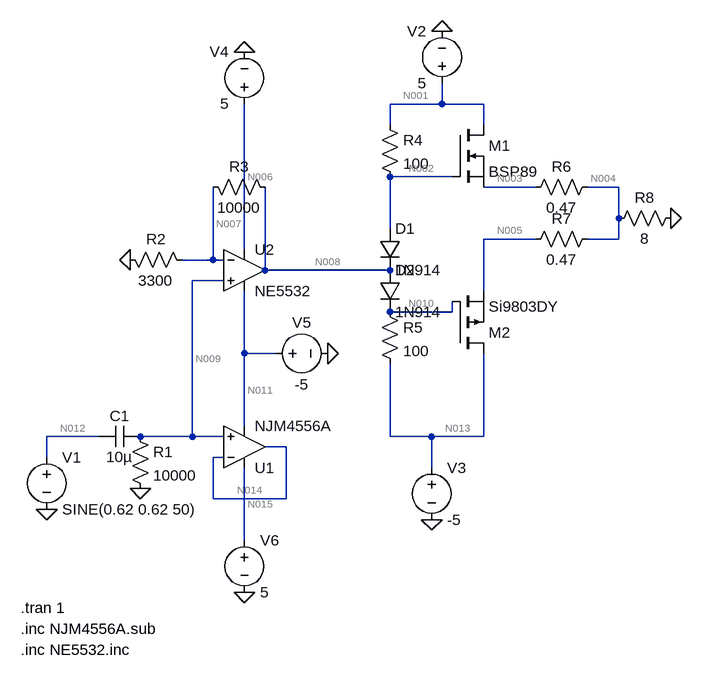
[diagram p0: schematic output.asc]
output.asc, the LTspice schematic file:
Version 4.1
SHEET 1 1060 680
WIRE 688 -400 688 -432
WIRE 688 -400 608 -400
WIRE 752 -400 688 -400
WIRE 608 -368 608 -400
WIRE 752 -368 752 -400
WIRE 704 -288 608 -288
WIRE 832 -272 752 -272
WIRE 960 -272 912 -272
WIRE 960 -224 960 -272
WIRE 608 -208 608 -288
WIRE 832 -192 752 -192
WIRE 960 -192 960 -224
WIRE 960 -192 912 -192
WIRE 384 -176 384 -400
WIRE 336 -160 336 -272
WIRE 336 -160 288 -160
WIRE 352 -160 336 -160
WIRE 416 -144 416 -272
WIRE 608 -144 416 -144
WIRE 352 -128 304 -128
WIRE 752 -112 752 -192
WIRE 704 -80 704 -96
WIRE 704 -80 608 -80
WIRE 384 -16 384 -112
WIRE 432 -16 384 -16
WIRE 384 96 384 -16
WIRE 160 112 80 112
WIRE 304 112 304 -128
WIRE 304 112 224 112
WIRE 352 112 304 112
WIRE 608 112 608 0
WIRE 672 112 608 112
WIRE 752 112 752 -16
WIRE 752 112 672 112
WIRE 448 128 416 128
WIRE 80 144 80 112
WIRE 352 144 336 144
WIRE 672 160 672 112
WIRE 336 208 336 144
WIRE 448 208 448 128
WIRE 448 208 336 208
WIRE 384 272 384 160
FLAG 80 224 0
FLAG 224 192 0
FLAG 208 -160 0
FLAG 1040 -224 0
FLAG 672 240 0
FLAG 688 -512 0
FLAG 384 -480 0
FLAG 512 -16 0
FLAG 384 352 0
SYMBOL voltage 80 128 R0
WINDOW 123 0 0 Left 0
WINDOW 39 0 0 Left 0
SYMATTR InstName V1
SYMATTR Value SINE(0.62 0.62 50)
SYMBOL cap 160 128 R270
WINDOW 0 32 32 VTop 2
WINDOW 3 0 32 VBottom 2
SYMATTR InstName C1
SYMATTR Value 10µ
SYMATTR Description Capacitor
SYMATTR Type cap
SYMATTR SpiceLine V=6.3 Irms=15m Rser=2.8021 Lser=879p mfg="Würth Elektronik" pn="865250140001 WCAP-ASNP 4x5,5" type="Al electrolytic"
SYMBOL res 208 96 R0
SYMATTR InstName R1
SYMATTR Value 10000
SYMBOL OpAmps\\opamp2 384 192 M180
SYMATTR InstName U1
SYMATTR Value NJM4556A
SYMBOL OpAmps\\opamp2 384 -208 R0
SYMATTR InstName U2
SYMATTR Value NE5532
SYMBOL res 192 -176 M90
WINDOW 0 0 56 VBottom 2
WINDOW 3 32 56 VTop 2
SYMATTR InstName R2
SYMATTR Value 3300
SYMBOL res 320 -288 M90
WINDOW 0 0 56 VBottom 2
WINDOW 3 32 56 VTop 2
SYMATTR InstName R3
SYMATTR Value 10000
SYMBOL res 928 -288 R90
WINDOW 0 0 56 VBottom 2
WINDOW 3 32 56 VTop 2
SYMATTR InstName R6
SYMATTR Value 0.47
SYMBOL res 928 -208 R90
WINDOW 0 0 56 VBottom 2
WINDOW 3 32 56 VTop 2
SYMATTR InstName R7
SYMATTR Value 0.47
SYMBOL res 1056 -240 R90
WINDOW 0 0 56 VBottom 2
WINDOW 3 32 56 VTop 2
SYMATTR InstName R8
SYMATTR Value 8
SYMBOL voltage 688 -416 R180
WINDOW 0 24 96 Left 2
WINDOW 3 24 16 Left 2
WINDOW 123 0 0 Left 0
WINDOW 39 0 0 Left 0
SYMATTR InstName V2
SYMATTR Value 5
SYMBOL voltage 672 144 R0
WINDOW 123 0 0 Left 0
WINDOW 39 0 0 Left 0
SYMATTR InstName V3
SYMATTR Value -5
SYMBOL voltage 416 -16 R270
WINDOW 0 32 56 VTop 2
WINDOW 3 -32 56 VBottom 2
WINDOW 123 0 0 Left 0
WINDOW 39 0 0 Left 0
SYMATTR InstName V5
SYMATTR Value -5
SYMBOL voltage 384 256 R0
WINDOW 123 0 0 Left 0
WINDOW 39 0 0 Left 0
SYMATTR InstName V6
SYMATTR Value 5
SYMBOL voltage 384 -384 R180
WINDOW 0 24 96 Left 2
WINDOW 3 24 16 Left 2
WINDOW 123 0 0 Left 0
WINDOW 39 0 0 Left 0
SYMATTR InstName V4
SYMATTR Value 5
SYMBOL nmos 704 -368 R0
SYMATTR InstName M1
SYMATTR Value BSP89
SYMBOL pmos 704 -16 M180
SYMATTR InstName M2
SYMATTR Value Si9803DY
SYMBOL diode 592 -208 R0
SYMATTR InstName D1
SYMATTR Value 1N914
SYMBOL diode 592 -144 R0
SYMATTR InstName D2
SYMATTR Value 1N914
SYMBOL res 592 -384 R0
SYMATTR InstName R4
SYMATTR Value 100
SYMBOL res 592 -96 R0
SYMATTR InstName R5
SYMATTR Value 100
TEXT 40 376 Left 2 !.tran 1
TEXT 40 408 Left 2 !.inc NJM4556A.sub
TEXT 40 440 Left 2 !.inc NE5532.inc

The netlist it stands for:
* output.asc
V1 N012 0 SINE(0.62 0.62 50)
C1 N012 N009 10µ V=6.3 Irms=15m Rser=2.8021 Lser=879p mfg="Würth Elektronik" pn="865250140001 WCAP-ASNP 4x5,5" type="Al electrolytic"
R1 N009 0 10000
X§U1 N009 N014 N015 N011 N014 NJM4556A  ; pins In+ In- V+ V- OUT
X§U2 N009 N007 N006 N011 N008 NE5532  ; pins In+ In- V+ V- OUT
R2 0 N007 3300
R3 N007 N008 10000
R6 N004 N003 0.47
R7 N004 N005 0.47
R8 0 N004 8
V2 N001 0 5
V3 N013 0 -5
V5 N011 0 -5
V6 N015 0 5
V4 N006 0 5
M1 N001 N002 N003 N003 BSP89
M2 N013 N010 N005 N005 Si9803DY
D1 N002 N008 1N914
D2 N008 N010 1N914
R4 N001 N002 100
R5 N010 N013 100
.model D D
.lib standard.dio
.model NMOS NMOS
.model PMOS PMOS
.lib standard.mos
.tran 1
.inc NJM4556A.sub
.inc NE5532.inc
.backanno
.end

* Results of the author's LTspice run, read from the files saved beside the schematic
* Operating Point, zero values left out:
*   V(n001) = 5 V
*   V(n002) = 764.8 mV
*   V(n003) = -4.48 µV
*   V(n004) = -4.48 µV
*   V(n005) = -4.744 µV
*   V(n006) = 5 V
*   V(n007) = -4.502 mV
*   V(n008) = -13.16 mV
*   V(n009) = -4.51 mV
*   V(n010) = -790.7 mV
*   V(n011) = -5 V
*   V(n012) = 620 mV
*   V(n013) = -5 V
*   V(n014) = -5.009 mV
*   V(n015) = 5 V
*   I(D1) = 42.35 mA
*   I(D2) = 42.09 mA
*   I(R1) = -451 nA
*   I(R2) = 1.364 µA
*   I(R3) = 866 nA
*   I(R4) = 42.35 mA
*   I(R5) = 42.09 mA
*   I(R6) = -10.72 pA
*   I(R7) = 560.1 nA
*   I(R8) = 560.1 nA
*   I(V2) = -42.35 mA
*   I(V3) = 42.09 mA
*   I(V4) = -1.421 mA
*   I(V5) = 4.827 mA
*   I(V6) = -3.407 mA
*   Id(M1) = 5.721 pA
*   Id(M2) = -560.1 nA
*   Is(M1) = -5.721 pA
*   Is(M2) = 560.1 nA
*   Ix(u1:1) = -47.31 nA
*   Ix(u1:2) = -52.32 nA
*   Ix(u1:3) = 3.407 mA
*   Ix(u1:4) = -3.405 mA
*   Ix(u1:5) = 52.32 nA
*   Ix(u2:1) = 498.3 nA
*   Ix(u2:2) = 498.3 nA
*   Ix(u2:3) = 1.421 mA
*   Ix(u2:4) = -1.422 mA
*   Ix(u2:5) = 259.9 µA
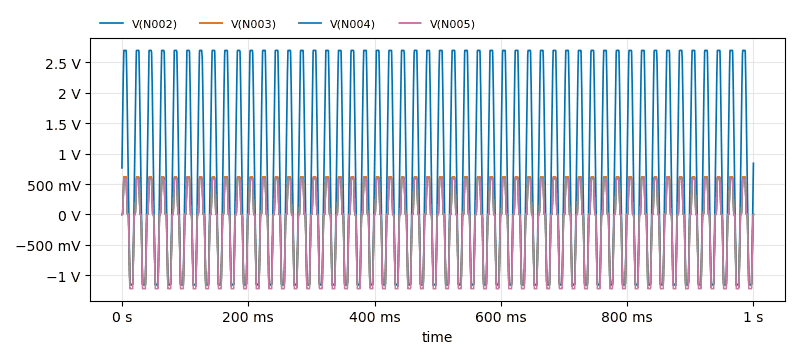
[diagram p1: Transient Analysis of output.asc, plotted from the saved traces]
* Transient Analysis, 1 run:
*   V(N002): min -1.153 V, max 2.699 V, average 762.5 mV, rms 1.72 V, last 842.3 mV
*   V(N003): min -1.154 V, max 618 mV, average -198.8 mV, rms 703.5 mV, last 2.902 µV
*   V(N004): min -1.154 V, max 583.7 mV, average -208.9 mV, rms 695.6 mV, last 2.89 µV
*   V(N005): min -1.222 V, max 583.7 mV, average -231.4 mV, rms 729 mV, last 3.048 µV